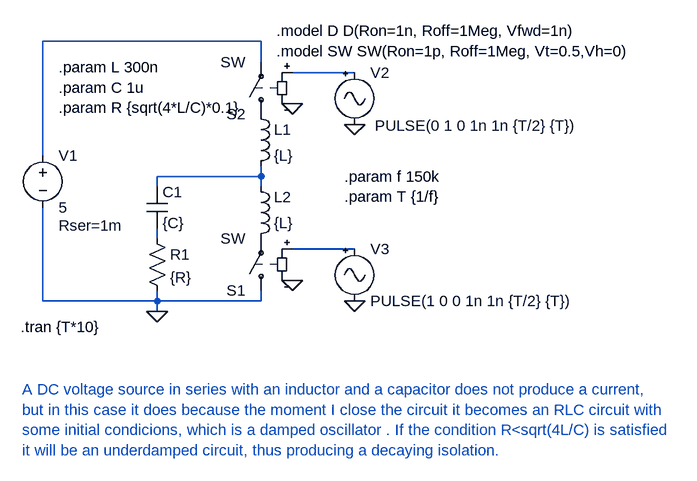
[diagram p0: schematic resonantseries.asc]
resonantseries.asc, the LTspice schematic file:
Version 4
SHEET 1 4080 680
WIRE 208 -112 -128 -112
WIRE 208 -80 208 -112
WIRE 352 -64 256 -64
WIRE -128 64 -128 -112
WIRE 208 96 208 80
WIRE 208 96 48 96
WIRE 48 112 48 96
WIRE 208 112 208 96
WIRE 48 192 48 176
WIRE 352 208 256 208
WIRE -128 288 -128 144
WIRE 48 288 48 272
WIRE 48 288 -128 288
WIRE 208 288 208 272
WIRE 208 288 48 288
WIRE 48 304 48 288
FLAG 48 304 0
FLAG 352 288 0
FLAG 352 16 0
FLAG 256 -16 0
FLAG 256 256 0
SYMBOL voltage -128 48 R0
WINDOW 123 0 0 Left 0
WINDOW 39 24 124 Left 2
SYMATTR InstName V1
SYMATTR Value 5
SYMATTR SpiceLine Rser=1m
SYMBOL ind 192 -16 R0
SYMATTR InstName L1
SYMATTR Value {L}
SYMATTR SpiceLine Rser=1n
SYMBOL ind 192 208 M180
WINDOW 0 36 80 Left 2
WINDOW 3 36 40 Left 2
SYMATTR InstName L2
SYMATTR Value {L}
SYMATTR SpiceLine Rser=1n
SYMBOL cap 32 112 R0
SYMATTR InstName C1
SYMATTR Value {C}
SYMBOL res 32 176 R0
SYMATTR InstName R1
SYMATTR Value {R}
SYMBOL sw 208 288 R180
SYMATTR InstName S1
SYMBOL sw 208 16 R180
SYMATTR InstName S2
SYMBOL Misc\\signal 352 -80 R0
WINDOW 3 31 98 Left 2
WINDOW 123 0 0 Left 0
WINDOW 39 0 0 Left 0
SYMATTR InstName V2
SYMATTR Value PULSE(0 1 0 1n 1n {T/2} {T})
SYMBOL Misc\\signal 352 192 R0
WINDOW 123 0 0 Left 0
WINDOW 39 0 0 Left 0
SYMATTR InstName V3
SYMATTR Value PULSE(1 0 0 1n 1n {T/2} {T})
TEXT -104 -72 Left 2 !.param L 300n\n.param C 1u\n.param R {sqrt(4*L/C)*0.1}
TEXT 336 96 Left 2 !.param f 150k\n.param T {1/f}
TEXT -162 328 Left 2 !.tran {T*10}
TEXT 232 -128 Left 2 !.model D D(Ron=1n, Roff=1Meg, Vfwd=1n)\n.model SW SW(Ron=1p, Roff=1Meg, Vt=0.5,Vh=0)
TEXT -160 424 Left 2 ;A DC voltage source in series with an inductor and a capacitor does not produce a current, \nbut in this case it does because the moment I close the circuit it becomes an RLC circuit with \nsome initial condicions, which is a damped oscillator . If the condition R<sqrt(4L/C) is satisfied \nit will be an underdamped circuit, thus producing a decaying isolation.

The netlist it stands for:
* resonantseries.asc
V1 N001 0 5 Rser=1m
L1 P001 N003 {L} Rser=1n
L2 P002 N003 {L} Rser=1n
C1 N003 N004 {C}
R1 N004 0 {R}
S1 0 P002 N005 0 SW
S2 P001 N001 N002 0 SW
V2 N002 0 PULSE(0 1 0 1n 1n {T/2} {T})
V3 N005 0 PULSE(1 0 0 1n 1n {T/2} {T})
.param L 300n
.param C 1u
.param R {sqrt(4*L/C)*0.1}
.param f 150k
.param T {1/f}
.tran {T*10}
.model D D(Ron=1n, Roff=1Meg, Vfwd=1n)
.model SW SW(Ron=1p, Roff=1Meg, Vt=0.5,Vh=0)
* A DC voltage source in series with an inductor and a capacitor does not produce a current,
* but in this case it does because the moment I close the circuit it becomes an RLC circuit with
* some initial condicions, which is a damped oscillator . If the condition R<sqrt(4L/C) is satisfied
* it will be an underdamped circuit, thus producing a decaying isolation.
.backanno
.end